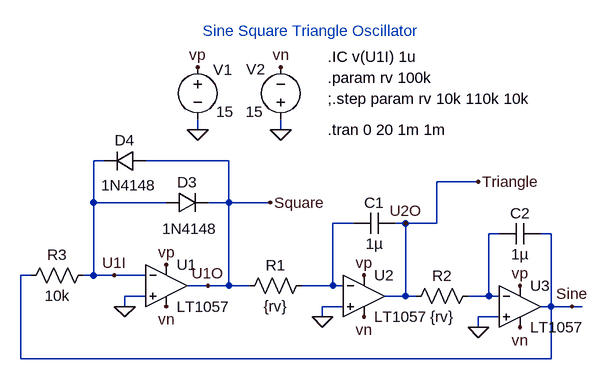
[diagram p0: schematic Oscillator.asc]
Oscillator.asc, the LTspice schematic file:
Version 4
SHEET 1 880 680
WIRE 0 -48 0 -64
WIRE 128 -48 128 -64
WIRE -144 0 -160 0
WIRE 48 0 -80 0
WIRE 432 32 368 32
WIRE -160 64 -160 0
WIRE -48 64 -160 64
WIRE 48 64 48 0
WIRE 48 64 16 64
WIRE 112 64 48 64
WIRE 240 96 208 96
WIRE 320 96 304 96
WIRE 368 96 368 32
WIRE 368 96 320 96
WIRE 464 112 448 112
WIRE 544 112 528 112
WIRE -256 176 -272 176
WIRE -160 176 -160 64
WIRE -160 176 -176 176
WIRE -128 176 -160 176
WIRE -80 176 -128 176
WIRE 16 192 -16 192
WIRE 48 192 48 64
WIRE 48 192 16 192
WIRE 80 192 48 192
WIRE 208 192 208 96
WIRE 208 192 160 192
WIRE 224 192 208 192
WIRE -80 208 -112 208
WIRE 320 208 320 96
WIRE 320 208 288 208
WIRE 336 208 320 208
WIRE 448 208 448 112
WIRE 448 208 416 208
WIRE 464 208 448 208
WIRE -112 224 -112 208
WIRE 224 224 192 224
WIRE 544 224 544 112
WIRE 544 224 528 224
WIRE 576 224 544 224
WIRE 592 224 576 224
WIRE 192 240 192 224
WIRE 464 240 432 240
WIRE 432 256 432 240
WIRE -272 304 -272 176
WIRE 544 304 544 224
WIRE 544 304 -272 304
FLAG 0 -48 0
FLAG 128 -48 0
FLAG 0 -144 vp
FLAG 128 -144 vn
FLAG -48 160 vp
FLAG 256 176 vp
FLAG 496 192 vp
FLAG -48 224 vn
FLAG 256 240 vn
FLAG 496 256 vn
FLAG 432 256 0
FLAG 192 240 0
FLAG -112 224 0
FLAG 576 224 Sine
FLAG 16 192 U1O
FLAG 320 96 U2O
FLAG -128 176 U1I
FLAG 432 32 Triangle
FLAG 112 64 Square
SYMBOL voltage 0 -160 R0
WINDOW 123 0 0 Left 0
WINDOW 39 0 0 Left 0
WINDOW 0 24 20 Left 0
WINDOW 3 29 84 Left 0
SYMATTR InstName V1
SYMATTR Value 15
SYMBOL voltage 128 -48 R180
WINDOW 0 24 93 Left 0
WINDOW 3 27 28 Left 0
WINDOW 123 0 0 Left 0
WINDOW 39 0 0 Left 0
SYMATTR InstName V2
SYMATTR Value 15
SYMBOL res 176 176 R90
WINDOW 0 0 56 VBottom 0
WINDOW 3 32 56 VTop 0
SYMATTR InstName R1
SYMATTR Value {rv}
SYMBOL res 432 192 R90
WINDOW 0 0 56 VBottom 0
WINDOW 3 32 56 VTop 0
SYMATTR InstName R2
SYMATTR Value {rv}
SYMBOL res -160 160 R90
WINDOW 0 0 56 VBottom 0
WINDOW 3 32 56 VTop 0
SYMATTR InstName R3
SYMATTR Value 10k
SYMBOL cap 304 80 R90
WINDOW 0 0 32 VBottom 0
WINDOW 3 32 32 VTop 0
SYMATTR InstName C1
SYMATTR Value 1µ
SYMBOL cap 528 96 R90
WINDOW 0 0 32 VBottom 0
WINDOW 3 32 32 VTop 0
SYMATTR InstName C2
SYMATTR Value 1µ
SYMBOL diode -48 48 M90
WINDOW 0 0 32 VBottom 0
WINDOW 3 41 36 VTop 0
SYMATTR InstName D3
SYMATTR Value 1N4148
SYMBOL diode -80 -16 R90
WINDOW 0 0 32 VBottom 0
WINDOW 3 38 26 VTop 0
SYMATTR InstName D4
SYMATTR Value 1N4148
SYMBOL OPAMPS\\LT1057 -48 128 R0
SYMATTR InstName U1
SYMBOL OPAMPS\\LT1057 256 144 R0
SYMATTR InstName U2
SYMBOL OPAMPS\\LT1057 496 160 R0
SYMATTR InstName U3
TEXT 200 -48 Left 0 !.tran 0 20 1m 1m
TEXT 200 -96 Left 0 !;.step param rv 10k 110k 10k
TEXT 8 -200 Left 0 ;Sine Square Triangle Oscillator
TEXT 200 -128 Left 0 !.param rv 100k
TEXT 200 -160 Left 0 !.IC v(U1I) 1u

The netlist it stands for:
* Oscillator.asc
V1 vp 0 15
V2 0 vn 15
R1 N001 Square {rv}
R2 N002 Triangle {rv}
R3 U1I Sine 10k
C1 Triangle N001 1µ
C2 Sine N002 1µ
D3 U1I Square 1N4148
D4 Square U1I 1N4148
XU1 0 U1I vp vn Square LT1057  ; pins In+ In- V+ V- OUT
XU2 0 N001 vp vn Triangle LT1057  ; pins In+ In- V+ V- OUT
XU3 0 N002 vp vn Sine LT1057  ; pins In+ In- V+ V- OUT
.model D D
.lib standard.dio
.tran 0 20 1m 1m
;.step param rv 10k 110k 10k
* Sine Square Triangle Oscillator
.param rv 100k
.IC v(U1I) 1u
.lib LTC.lib
.backanno
.end